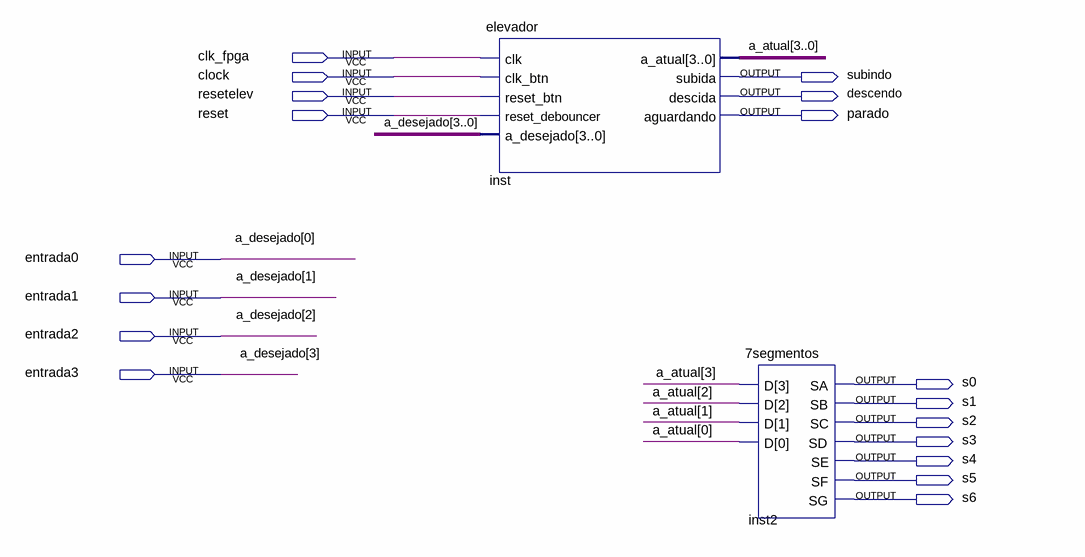
[diagram p0: schematic sheet]
// Quartus schematic test.bdf as structural Verilog: 2 symbols, 18 pins
module test (
  input  clk_fpga,
  input  clock,
  input  resetelev,
  input  reset,
  input  entrada0,
  input  entrada1,
  input  entrada2,
  input  entrada3,
  output subindo,
  output descendo,
  output parado,
  output s0,
  output s1,
  output s2,
  output s3,
  output s4,
  output s5,
  output s6
);

  wire [3:0] a_atual;

  elevador inst (
    .clk(clk_fpga), .clk_btn(clock), .reset_btn(resetelev), .reset_debouncer(reset),
    .a_desejado({entrada3, entrada2, entrada1, entrada0}), .a_atual(a_atual), .subida(subindo),
    .descida(descendo), .aguardando(parado));
  \7segmentos  inst2 (.D(a_atual), .SA(s0), .SB(s1), .SC(s2), .SD(s3), .SE(s4), .SF(s5), .SG(s6));

  // Other names for the same wires on the sheet: a_desejado[3:0] = {entrada3, entrada2, entrada1, entrada0}
endmodule
